# Altium project PCB_My_SHIP.PrjPcb
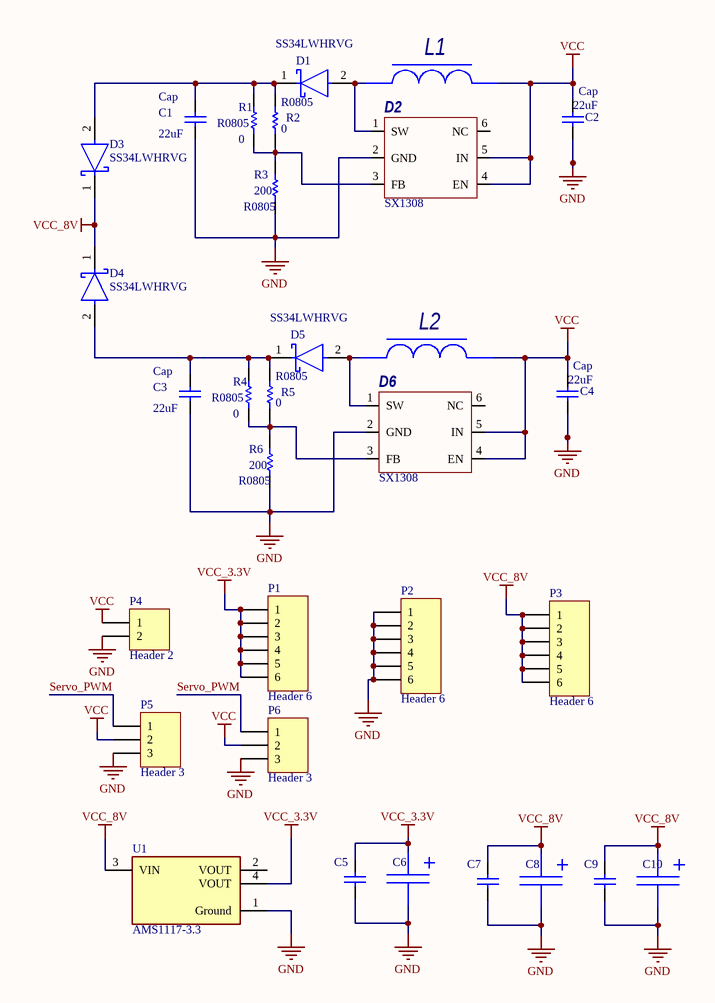
[diagram p0: My_Ship_Sheet1.SchDoc]
1 sheet, 31 parts. Net scope: global (net labels, ports and power ports of the same name join across sheets).
Board file: My_Ship_PCB1.PcbDoc

## Sheet My_Ship_Sheet1.SchDoc
size A4

### Parts
C1  Cap  value 22uF  [C1206]
C2  Cap  value 22uF  [C1206]
C3  Cap  value 22uF  [C1206]
C4  Cap  value 22uF  [C1206]
C5  C0603  [C0603]  (value not drawn)
C6  Capacitor-T  [R38]  (value not drawn)
C7  C0603  [C0603]  (value not drawn)
C8  Capacitor-T  [R38]  (value not drawn)
C9  C0603  [C0603]  (value not drawn)
C10  Capacitor-T  [R38]  (value not drawn)
D1  SS34LWHRVG  [FP-SS34LWH-MFG]
D2  SX1308  [SX1308]
D3  SS34LWHRVG  [FP-SS34LWH-MFG]
D4  SS34LWHRVG  [FP-SS34LWH-MFG]
D5  SS34LWHRVG  [FP-SS34LWH-MFG]
D6  SX1308  [SX1308]
L1  Coil  [МДГ-1]  (value not drawn)
L2  Coil  [МДГ-1]  (value not drawn)
P1  Header 6  [HDR1X6]
P2  Header 6  [HDR1X6]
P3  Header 6  [HDR1X6]
P4  Header 2  [HDR1X2]
P5  Header 3  [HDR1X3]
P6  Header 3  [HDR1X3]
R1  R0805  value 0  [R0805]
R2  R0805  value 0  [R0805]
R3  R0805  value 200  [R0805]
R4  R0805  value 0  [R0805]
R5  R0805  value 0  [R0805]
R6  R0805  value 200  [R0805]
U1  AMS1117-3.3  [FP-AMS1117-IPC_B]

### Nets
GND: C1.1 C2.1 C3.1 C4.1 C5.2 C6.2 C7.2 C8.2 C9.2 C10.2 D2.2(GND) D6.2(GND) P2.1 P2.2 P2.3 P2.4 P2.5 P2.6 P4.2 P5.3 P6.3 R3.1 R6.1 U1.1(Ground)
VCC: C2.2 C4.2 D2.4(EN) D2.5(IN) D6.4(EN) D6.5(IN) L1.2 L2.2 P4.1 P5.2 P6.2
VCC_3.3V: C5.1 C6.1 P1.1 P1.2 P1.3 P1.4 P1.5 P1.6 U1.4(VOUT)
VCC_8V: C7.1 C8.1 C9.1 C10.1 D3.1(C) D4.1(C) P3.1 P3.2 P3.3 P3.4 P3.5 P3.6 U1.3(VIN)
Servo_PWM: P5.1 P6.1
NetC1_2: C1.2 D1.1(C) D3.2(A) R1.2 R2.2
NetC3_2: C3.2 D4.2(A) D5.1(C) R4.2 R5.2
NetD1_2: D1.2(A) D2.1(SW) L1.1
NetD2_3: D2.3(FB) R1.1 R2.1 R3.2
NetD5_2: D5.2(A) D6.1(SW) L2.1
NetD6_3: D6.3(FB) R4.1 R5.1 R6.2

Not connected (* = marked no-connect by the designer): D2 6(NC); D6 6(NC); U1 2(VOUT)

### Library data of the parts
C1-C4 = Cap: Capacitor; Published: 8-Jun-2000; LatestRevisionDate: 17-Jul-2002; LatestRevisionNote: Re-released for DXP Platform.; PackageReference: RAD-0.3; Publisher: Altium Limited; PackageDescription: Radial Cap, Thru-Hole; 2 Leads; 0.3 in Pin Spacing
C5 C7 C9 = Cap: Capacitor; Value: 100pF; Published: 8-Jun-2000; LatestRevisionDate: 17-Jul-2002; LatestRevisionNote: Re-released for DXP Platform.; PackageReference: RAD-0.3; Publisher: Altium Limited; PackageDescription: Radial Cap, Thru-Hole; 2 Leads; 0.3 in Pin Spacing
C6 C8 C10 = Capacitor-T: Type: Конденсатор; Published: 23.04.2010; Publisher: Andrew Danich
D1 D3-D5 = CMP-15604-000001-1: DIODE SCHOTTKY 40V 3A SOD123W; RoHS Compliant: Yes
L1 L2 = МДГ1-1500: Manufacturer: ОАО "МСТАТОР"; Type: Дроссель; ID: 13; Value: 1.5uH; Rated Current: 1A; Tolerance: ±10%; Q: 15; DC Resistance: 0.35ohm; Specification: КВШУ.670114.001 ТУ; Application Category: 5; Working Temperature Min: -60°С; Working Temperature Max: +85°С; Published: 20.05.2010; Publisher: Andrew Danich; Part Number: МДГ1-1500
P1-P3 = Header 6: Header, 6-Pin; LatestRevisionDate: 17-Jul-2002; LatestRevisionNote: Re-released for DXP Platform.; Publisher: Altium Limited
P4 = Header 2: Header, 2-Pin; LatestRevisionDate: 17-Jul-2002; LatestRevisionNote: Re-released for DXP Platform.; Publisher: Altium Limited
P5 P6 = Header 3: Header, 3-Pin; LatestRevisionDate: 17-Jul-2002; LatestRevisionNote: Re-released for DXP Platform.; Publisher: Altium Limited
R1-R6 = Res1: Resistor; Published: 8-Jun-2000; LatestRevisionDate: 17-Jul-2002; LatestRevisionNote: Re-released for DXP Platform.; PackageReference: AXIAL-0.3; Publisher: Altium Limited; PackageDescription: Axial Device, Thru-Hole; 2 Leads; 0.3 in Pin Spacing
U1 = CMP-209535-000001-1: LDO Voltage Regulators 1A, 3.3V; Manufacturer: Advanced Monolithic Systems; Dropout Voltage: 1.1V; Output Type: Fixed; Nominal Supply Current: 5mA; Max Power Dissipation: 1.2W; Max Supply Voltage: 15V; Number Of Outputs: 1; Standoff Height: 0.64mm; Max Junction Temp: +125°C; Height: 1.8mm; Package: AMS1117; Device Class L2: Power Management ICs; ComponentLink2Description: Datasheet; ComponentLink2URL: http://www.advanced-monolithic.com/pdf/ds1117.pdf; Category: IC; RoHS: TRUE; Automotive: No; Device Class L1: Integrated Circuits (ICs); Output Current: 1A; Device Class L3: Voltage Regulators - Linear; Temperature: -40°C to +125°C; Output Voltage: 3.3V; Manufacturer Part Number: AMS1117-3.3; Temperature Range Low: -40°C; Octopart: https://octopart.com/ams1117-3.3-advanced+monolithic+systems-25899300; Lead Free: Yes; Ipc Land Pattern Name: SOT229P700X180-4; Temperature Range High: +125°C